# EasyEDA schematic 1-Schematic_Illuno_Atmega328pu_V1.json
TITLE: ILLUME - PCB Design; REV: 1.0; Date: 2020-12-12; Sheet: 1/1; Drawn By: Shujan Pannag J; Company: NISB
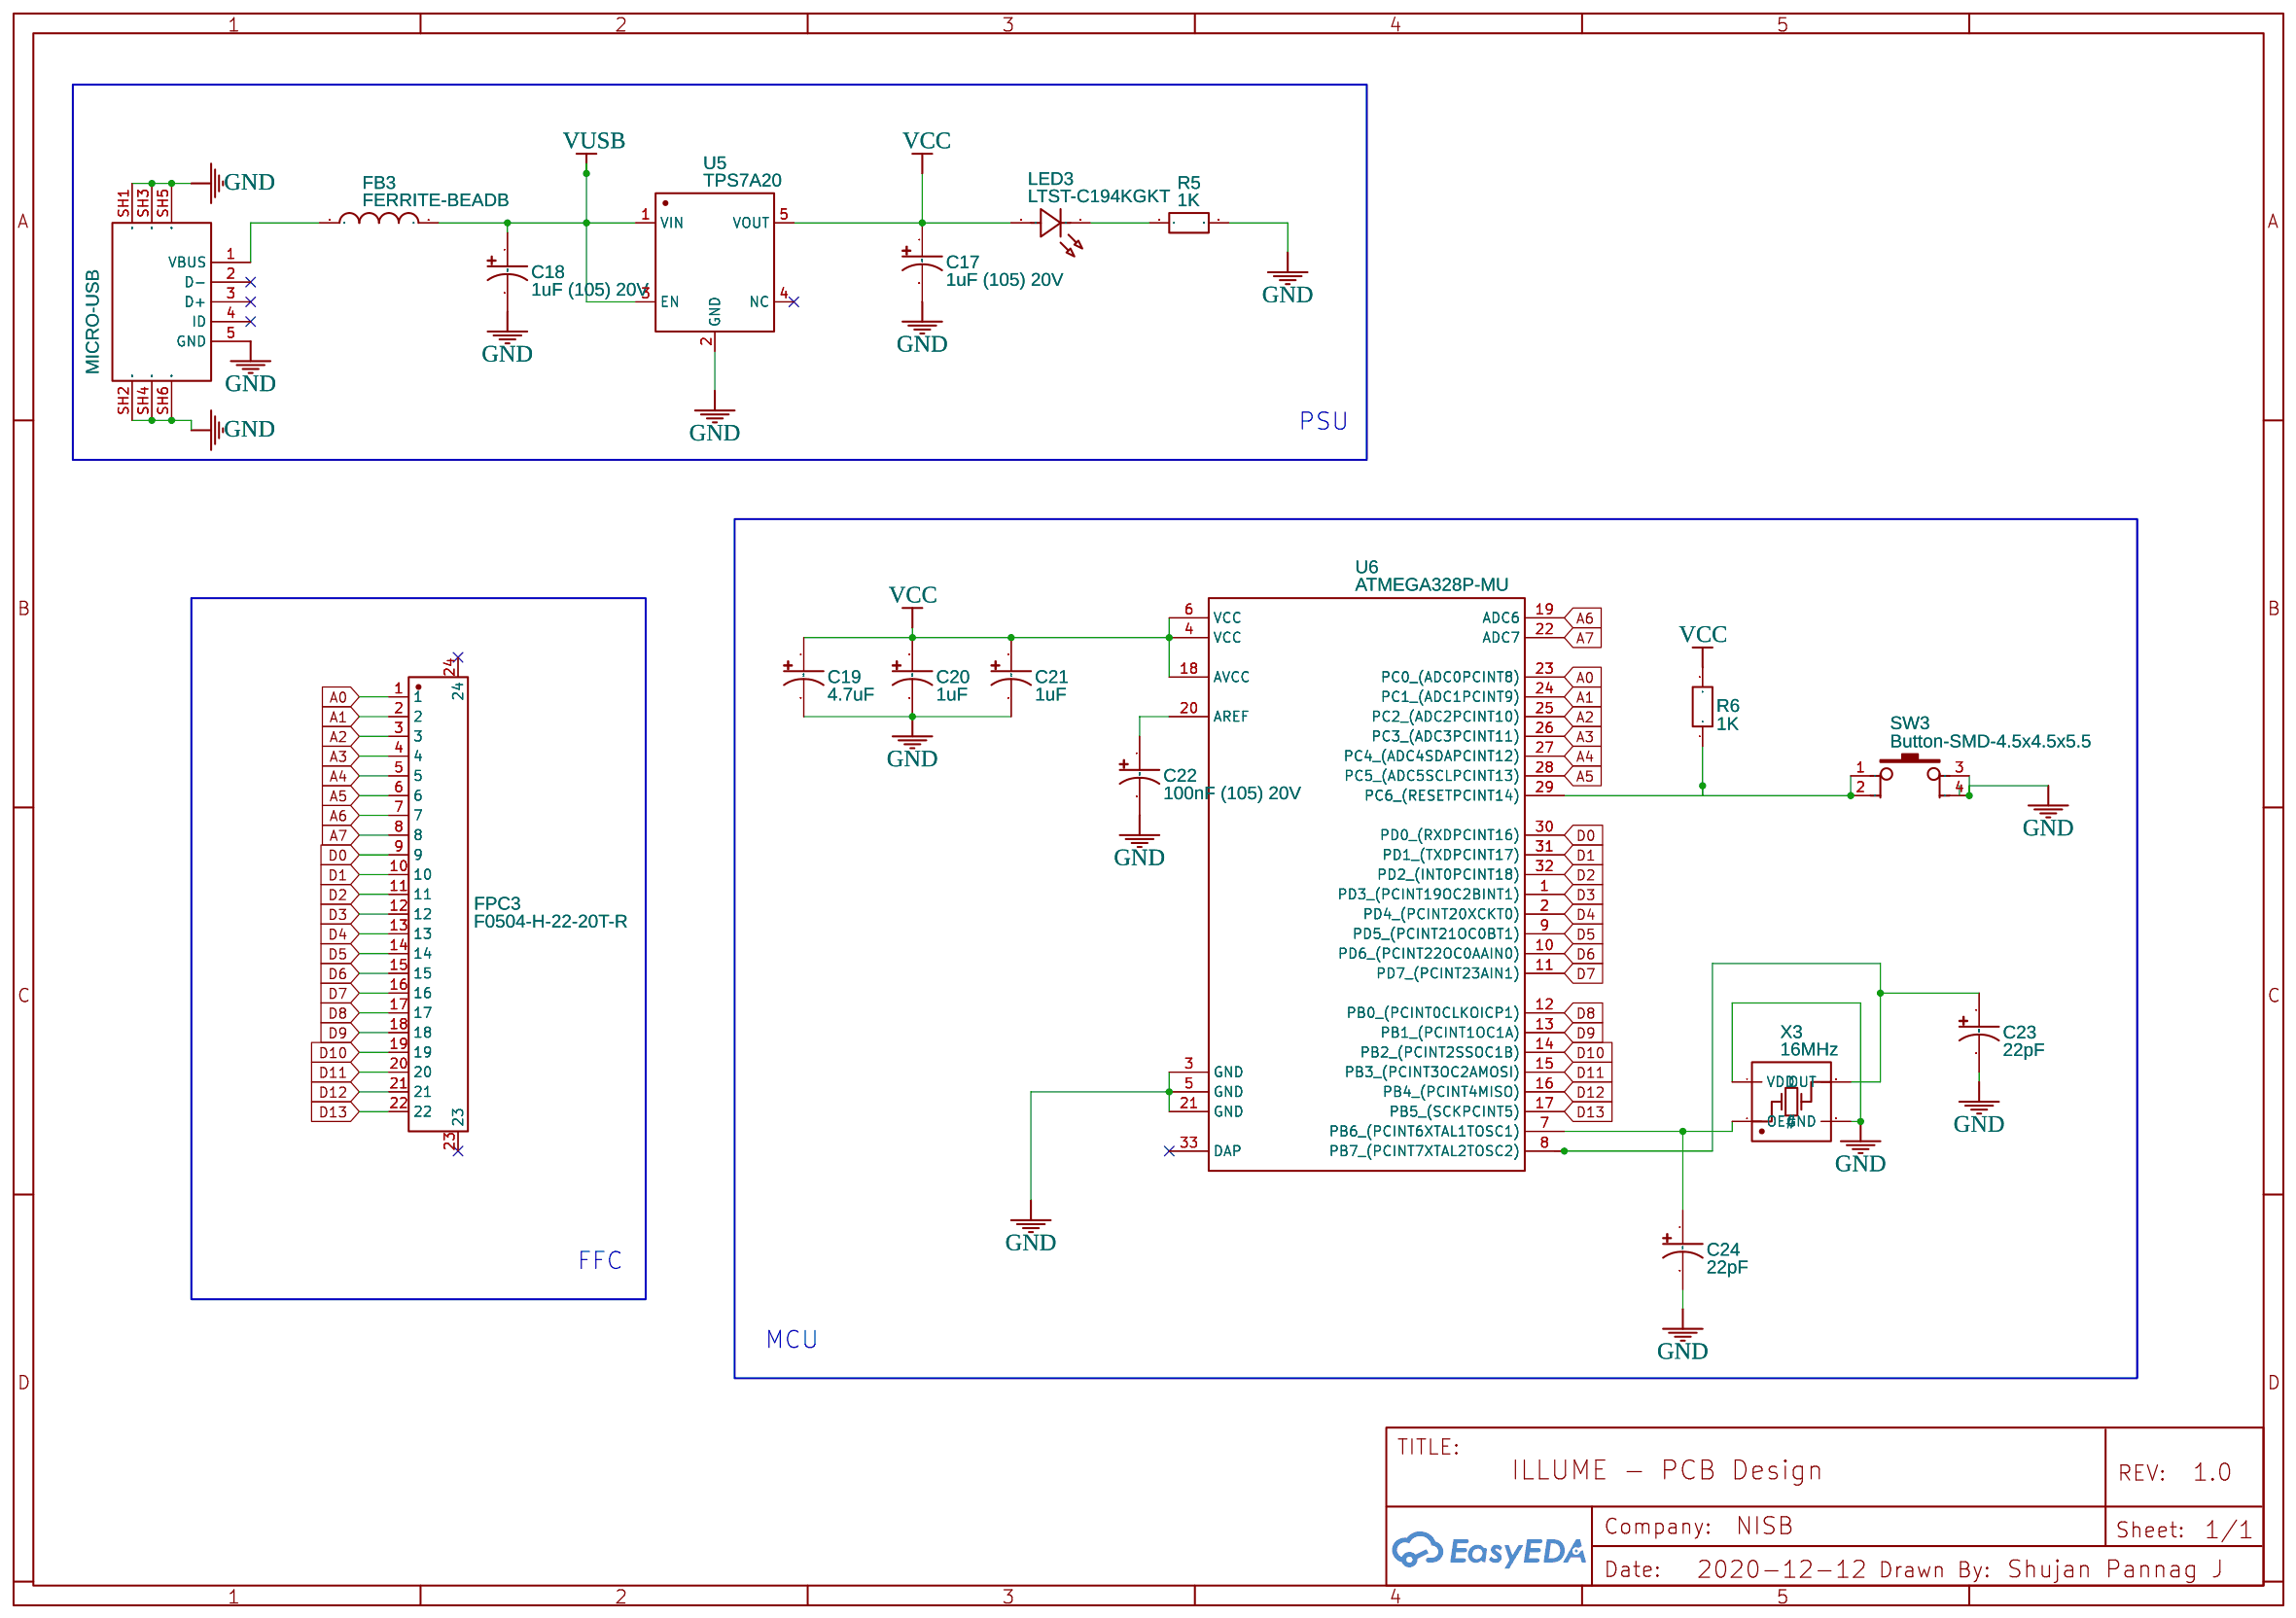
[diagram p0: schematic sheet]

## Parts
C17  1uF (105) 20V  [CAP-SMD_L3.2-W1.6]
C18  1uF (105) 20V  [CAP-SMD_L3.2-W1.6]
C19  4.7uF  [CAP-SMD_L3.2-W1.6]
C20  1uF  [CAP-SMD_L3.2-W1.6]
C21  1uF  [CAP-SMD_L3.2-W1.6]
C22  100nF (105) 20V  [CAP-SMD_L3.2-W1.6]
C23  22pF  [CAP-SMD_L3.2-W1.6]
C24  22pF  [CAP-SMD_L3.2-W1.6]
CN3  MICRO-USB  [MICRO-USB-B_5P-FEMALE_A01SB]
FB3  FERRITE-BEADB  [0805]
FPC3  F0504-H-22-20T-R  [PFC-SMD_F0504-H-22-20T-R]
LED3  LTST-C194KGKT  [LED0603-RD]
R5  1K  [R0805]
R6  1K  [R0805]
SW3  Button-SMD-4.5x4.5x5.5  [SW-SMD_4PIN-L4.50-W4.50]
U5  TPS7A20  [SOT-23-5_L3.0-W1.7-P0.95-LS2.8-TL]
U6  ATMEGA328P-MU  [QFN-32_L5.0-W5.0-P0.50-BL-EP3.4]
X3  16MHz  [OSC-SMD_4P-L3.2-W2.5-BL]

## Library data of the parts
C17-C24 = 1uF (105) 20V: Supplier: LCSC; Supplier Part: C28170; Manufacturer: AVX; Contributor: LCSC
CN3 = MICRO-USB-BF-5P: Supplier Part: C46390; Supplier: LCSC; Manufacturer: ValuePro; Manufacturer Part: MICRO 5PFemaleBtype
FB3 = FERRITE-BEADB
FPC3 = F0504-H-22-20T-R: Supplier: LCSC; Supplier Part: C557729; Manufacturer: XFCN; Contributor: LCSC
LED3 = LTST-C194KGKT: Supplier: LCSC; Supplier Part: C913102; Manufacturer: Lite-On; Contributor: LCSC
R5 R6 = CR-05JA7---47K: Supplier: LCSC; Supplier Part: C881909; Manufacturer: Viking Tech; Contributor: LCSC
SW3 = Button-SMD-4.5x4.5x5.5: Supplier Part: C71849; Supplier: LCSC; Manufacturer: BBJ; Manufacturer Part: 4.5*4.5*5.5 Plastic head,260G, 0.25mm,SMD
U5 = TPS7A20: Manufacturer: TI; Supplier: Mouser; link: https://www.ti.com/product/TPS7A20#tech-docs; Contributor: nikolacollins
U6 = ATMEGA328P-MU: Supplier: LCSC; Manufacturer: MICROCHIP; image: //image.lceda.cn/szlcsc/C38896.jpg; Supplier Part: C38896; Contributor: 立创EDA官方封装库; SMT Type: Extend; JLCPCB SMD: Yes
X3 = HSO321S 27MHZ 3.3V: Supplier: LCSC; Supplier Part: C160453; Manufacturer: Harmony Elec; Contributor: LCSC

## Nets
GND: C17.2 C18.2 C19.2 C20.2 C21.2 C22.2 C23.2 C24.2 CN3.5(GND) CN3.SH1 CN3.SH2 CN3.SH3 CN3.SH4 CN3.SH5 CN3.SH6 R5.2 SW3.3 SW3.4 U5.2(GND) U6.3(GND) U6.5(GND) U6.21(GND) X3.2(GND) X3.4(VDD)
VCC: C17.1 C19.1 C20.1 C21.1 LED3.2(A) R6.2 U5.5(VOUT) U6.4(VCC) U6.6(VCC) U6.18(AVCC)
A0: FPC3.1 U6.23(PC0 (ADC0PCINT8))
A1: FPC3.2 U6.24(PC1 (ADC1PCINT9))
A2: FPC3.3 U6.25(PC2 (ADC2PCINT10))
A3: FPC3.4 U6.26(PC3 (ADC3PCINT11))
A4: FPC3.5 U6.27(PC4 (ADC4SDAPCINT12))
A5: FPC3.6 U6.28(PC5 (ADC5SCLPCINT13))
A6: FPC3.7 U6.19(ADC6)
A7: FPC3.8 U6.22(ADC7)
D0: FPC3.9 U6.30(PD0 (RXDPCINT16))
D1: FPC3.10 U6.31(PD1 (TXDPCINT17))
D2: FPC3.11 U6.32(PD2 (INT0PCINT18))
D3: FPC3.12 U6.1(PD3 (PCINT19OC2BINT1))
D4: FPC3.13 U6.2(PD4 (PCINT20XCKT0))
D5: FPC3.14 U6.9(PD5 (PCINT21OC0BT1))
D6: FPC3.15 U6.10(PD6 (PCINT22OC0AAIN0))
D7: FPC3.16 U6.11(PD7 (PCINT23AIN1))
D8: FPC3.17 U6.12(PB0 (PCINT0CLKOICP1))
D9: FPC3.18 U6.13(PB1 (PCINT1OC1A))
D10: FPC3.19 U6.14(PB2 (PCINT2SSOC1B))
D11: FPC3.20 U6.15(PB3 (PCINT3OC2AMOSI))
D12: FPC3.21 U6.16(PB4 (PCINT4MISO))
D13: FPC3.22 U6.17(PB5 (SCKPCINT5))
VUSB: C18.1 FB3.2 U5.1(VIN) U5.3(EN)
Net-(C22-1): C22.1 U6.20(AREF)
Net-(C23-1): C23.1 U6.8(PB7 (PCINT7XTAL2TOSC2)) X3.3(OUT)
Net-(C24-1): C24.1 U6.7(PB6 (PCINT6XTAL1TOSC1)) X3.1(OE#)
Net-(CN3-1): CN3.1(VBUS) FB3.1
Net-(LED3-1): LED3.1(K) R5.1
Net-(R6-1): R6.1 SW3.1 SW3.2 U6.29(PC6 (RESETPCINT14))

Not connected (* = marked no-connect by the designer): CN3 2(D-)* 3(D+)* 4(ID)*; FPC3 23* 24*; U5 4(NC)*; U6 33(DAP)*

## Notes on the sheet
- PSU
- FFC
- MCU
